# Altium schematic sheet LEDdriver-LM3409 - Strobe.SchDoc
size A4
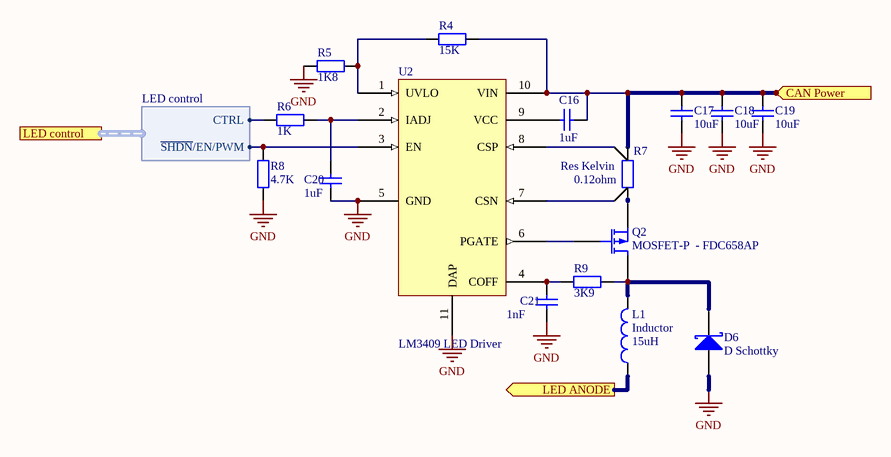
[diagram p0: LEDdriver-LM3409 - Strobe.SchDoc]

## Parts
C16  value 1uF  [C0603]  (hidden comment: Cap)
C17  value 10uF  [Capacitor 1210 (3225) package]  (hidden comment: Cap)
C18  value 10uF  [Capacitor 1210 (3225) package]  (hidden comment: Cap)
C19  value 10uF  [Capacitor 1210 (3225) package]  (hidden comment: Cap)
C20  value 1uF  [C0603]  (hidden comment: Cap)
C21  value 1nF  [C0603]  (hidden comment: Cap)
D6  D Schottky  [Schottky rectifier]
L1  Inductor  value 15uH  [Inductor 3131]
Q2  MOSFET-P  - FDC658AP  [SuperSOT6 - FDC658AP]
R4  value 15K  [R0603]  (hidden comment: Res)
R5  value 1K8  [R0603]  (hidden comment: Res)
R6  value 1K  [R0603]  (hidden comment: Res)
R7  Res Kelvin  value 0.12ohm  [2512 package + Kelvin Cons - ERJ1TR Rsns]  (net tie)
R8  value 4.7K  [R0603]  (hidden comment: Res)
R9  value 3K9  [R0603]  (hidden comment: Res)
U2  LM3409 LED Driver  [10eMSOP + thermal pad - LM3409]

## Ports
CAN Power (in), LED ANODE (out), LED control (harness LED control)

## Harnesses
LED control: CTRL, ~{SHDN}/EN/PWM

## Nets
GND: C17.2 C18.2 C19.2 C20.2 C21.2 D6.1(A) R5.2 R8.1 U2.5(GND) U2.11(DAP)
CAN Power: C16.1 C17.1 C18.1 C19.1 R4.1 R7.2 U2.10(VIN) ; port CAN Power
LED ANODE: L1.1 ; port LED ANODE
NetC16_2: C16.2 U2.9(VCC)
NetC20_1: C20.1 R6.1 U2.2(IADJ)
NetC21_1: C21.1 R9.2 U2.4(COFF)
NetD6_2: D6.2(K) L1.2 Q2.1(D) R9.1
NetQ2_2: Q2.2(G) U2.6(PGATE)
NetQ2_3: Q2.3(S) R7.1
NetR4_2: R4.2 R5.1 U2.1(UVLO)
NetR6_2: R6.2 ; port LED control.CTRL
NetR7_3: R7.3 U2.7(CSN)
NetR7_4: R7.4 U2.8(CSP)
NetR8_2: R8.2 U2.3(EN) ; port LED control.~{SHDN}/EN/PWM

## Library data of the parts
C16-C21 = Cap: Capacitor; Published: 8-Jun-2000; LatestRevisionDate: 17-Jul-2002; LatestRevisionNote: Re-released for DXP Platform.; PackageReference: RAD-0.3; Publisher: Altium Limited
  C16 C20: farnell: 1907508 £0.22
  C17-C19: farnell: 1735537 £2.18
  C21: farnell: 1759088
D6 = D Schottky: Schottky Diode; Published: 8-Jun-2000; LatestRevisionDate: 17-Jul-2002; LatestRevisionNote: Re-released for DXP Platform.; PackageReference: SMB; Publisher: Altium Limited; Code_JEDEC: DO-214-AA; farnell: 1467550 £0.21
L1 = Inductor: Code_IEC: 1005; Published: 8-Jun-2000; LatestRevisionDate: 29-May-2009; LatestRevisionNote: IPC-7351 Footprint Added.; PackageReference: 0402-A; Publisher: Altium Limited; PackageDescription: Chip Inductor; Code_JEITA: 0402; Farnell: 1782825 £0.33
Q2 = MOSFET-P: P-Channel MOSFET; Published: 8-Jun-2000; LatestRevisionDate: 17-Jul-2002; LatestRevisionNote: Re-released for DXP Platform.; PackageVersion: 1995/1996; PackageReference: E3; Publisher: Altium Limited; Farnell: 1495228 £0.68
R4-R6 R8 R9 = Res2: Resistor
  R4: farnell: 9330615
  R5: farnell: 9330712
  R6: farnell: 9330380
  R8: farnell: 9331247
  R9: farnell: 9331140
R7 = Res Kelvin: Resistor Kelvin; Published: 8-Jun-2000; LatestRevisionDate: 17-Jul-2002; LatestRevisionNote: Re-released for DXP Platform.; PackageReference: AXIAL-0.4; Publisher: Altium Limited
U2 = LM3409: PFET Buck Controller for High Power LED Drivers; Farnell: 1778582 £2.77